# Altium schematic sheet multiplexers.SchDoc
size Letter
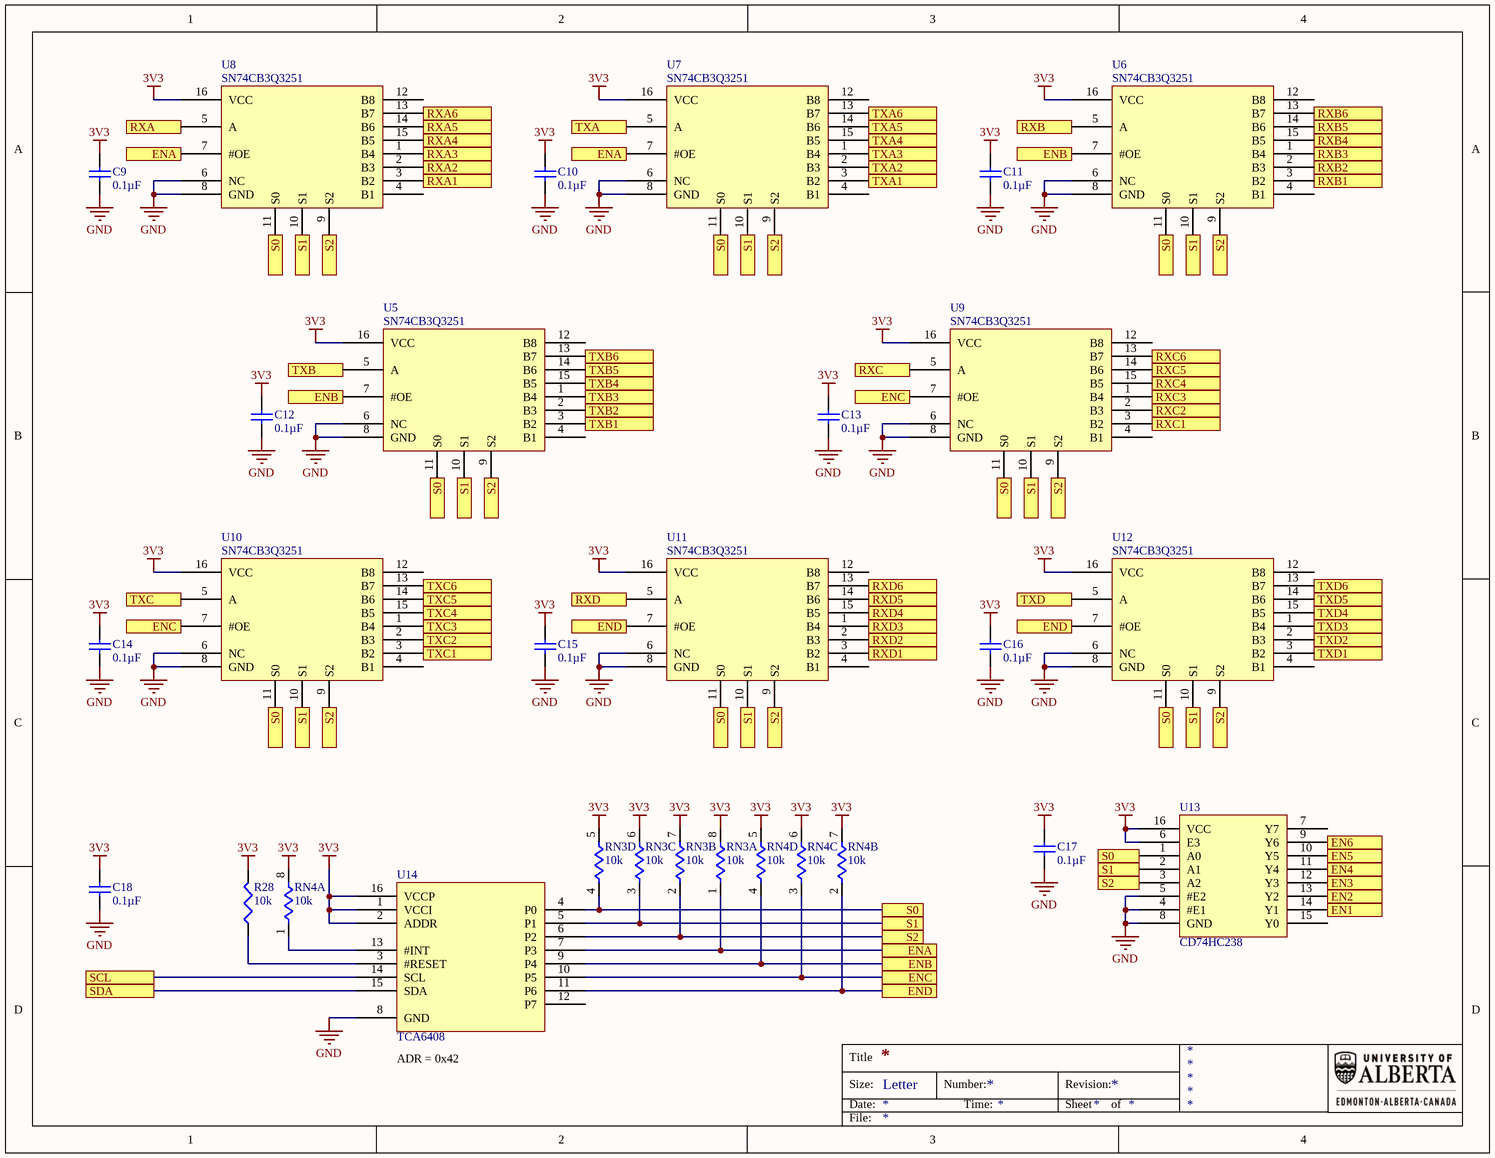
[diagram p0: multiplexers.SchDoc]

## Parts
C9  value 0.1µF  [TDK-CGA3E]  (hidden comment: Cap)
C10  value 0.1µF  [TDK-CGA3E]  (hidden comment: Cap)
C11  value 0.1µF  [TDK-CGA3E]  (hidden comment: Cap)
C12  value 0.1µF  [TDK-CGA3E]  (hidden comment: Cap)
C13  value 0.1µF  [TDK-CGA3E]  (hidden comment: Cap)
C14  value 0.1µF  [TDK-CGA3E]  (hidden comment: Cap)
C15  value 0.1µF  [TDK-CGA3E]  (hidden comment: Cap)
C16  value 0.1µF  [TDK-CGA3E]  (hidden comment: Cap)
C17  value 0.1µF  [TDK-CGA3E]  (hidden comment: Cap)
C18  value 0.1µF  [TDK-CGA3E]  (hidden comment: Cap)
R28  value 10k  [PANA-ERJ3EK]  (hidden comment: Res3)
RN3  value 10k  [PANA-EXB1206]  (hidden comment: Res4 Pack1)  (parts A,B,C,D of 4)
RN4  value 10k  [PANA-EXB1206]  (hidden comment: Res4 Pack1)  (parts A,B,C,D of 4)
U5  SN74CB3Q3251  [TI-PW]
U6  SN74CB3Q3251  [TI-PW]
U7  SN74CB3Q3251  [TI-PW]
U8  SN74CB3Q3251  [TI-PW]
U9  SN74CB3Q3251  [TI-PW]
U10  SN74CB3Q3251  [TI-PW]
U11  SN74CB3Q3251  [TI-PW]
U12  SN74CB3Q3251  [TI-PW]
U13  CD74HC238  [TI-PW]
U14  TCA6408  [TI-PW]

## Ports
EN1, EN2, EN3, EN4, EN5, EN6, ENA, ENB, ENC, END, RXA, RXA1, RXA2, RXA3, RXA4, RXA5, RXA6, RXB, RXB1, RXB2, RXB3, RXB4, RXB5, RXB6, RXC, RXC1, RXC2, RXC3, RXC4, RXC5, RXC6, RXD, RXD1, RXD2, RXD3, RXD4, RXD5, RXD6, S0, S1, S2, SCL, SDA, TXA, TXA1, TXA2, TXA3, TXA4, TXA5, TXA6, TXB, TXB1, TXB2, TXB3, TXB4, TXB5, TXB6, TXC, TXC1, TXC2, TXC3, TXC4, TXC5, TXC6, TXD, TXD1, TXD2, TXD3, TXD4, TXD5, TXD6

## Nets
3V3: C9.2 C10.2 C11.2 C12.2 C13.2 C14.2 C15.2 C16.2 C17.2 C18.2 R28.2 RN3.5 RN3.6 RN3.7 RN3.8 RN4.5 RN4.6 RN4.7 RN4.8 U5.16(VCC) U6.16(VCC) U7.16(VCC) U8.16(VCC) U9.16(VCC) U10.16(VCC) U11.16(VCC) U12.16(VCC) U13.6(E3) U13.16(VCC) U14.1(VCCI) U14.2(ADDR) U14.16(VCCP)
GND: C9.1 C10.1 C11.1 C12.1 C13.1 C14.1 C15.1 C16.1 C17.1 C18.1 U5.6(NC) U5.8(GND) U6.6(NC) U6.8(GND) U7.6(NC) U7.8(GND) U8.6(NC) U8.8(GND) U9.6(NC) U9.8(GND) U10.6(NC) U10.8(GND) U11.6(NC) U11.8(GND) U12.6(NC) U12.8(GND) U13.4(#E1) U13.5(#E2) U13.8(GND) U14.8(GND)
EN1: U13.14(Y1) ; port EN1
EN2: U13.13(Y2) ; port EN2
EN3: U13.12(Y3) ; port EN3
EN4: U13.11(Y4) ; port EN4
EN5: U13.10(Y5) ; port EN5
EN6: U13.9(Y6) ; port EN6
ENA: RN3.1 U7.7(#OE) U8.7(#OE) U14.7(P3) ; port ENA
ENB: RN4.4 U5.7(#OE) U6.7(#OE) U14.9(P4) ; port ENB
ENC: RN4.3 U9.7(#OE) U10.7(#OE) U14.10(P5) ; port ENC
END: RN4.2 U11.7(#OE) U12.7(#OE) U14.11(P6) ; port END
RXA: U8.5(A) ; port RXA
RXA1: U8.3(B2) ; port RXA1
RXA2: U8.2(B3) ; port RXA2
RXA3: U8.1(B4) ; port RXA3
RXA4: U8.15(B5) ; port RXA4
RXA5: U8.14(B6) ; port RXA5
RXA6: U8.13(B7) ; port RXA6
RXB: U6.5(A) ; port RXB
RXB1: U6.3(B2) ; port RXB1
RXB2: U6.2(B3) ; port RXB2
RXB3: U6.1(B4) ; port RXB3
RXB4: U6.15(B5) ; port RXB4
RXB5: U6.14(B6) ; port RXB5
RXB6: U6.13(B7) ; port RXB6
RXC: U9.5(A) ; port RXC
RXC1: U9.3(B2) ; port RXC1
RXC2: U9.2(B3) ; port RXC2
RXC3: U9.1(B4) ; port RXC3
RXC4: U9.15(B5) ; port RXC4
RXC5: U9.14(B6) ; port RXC5
RXC6: U9.13(B7) ; port RXC6
RXD: U11.5(A) ; port RXD
RXD1: U11.3(B2) ; port RXD1
RXD2: U11.2(B3) ; port RXD2
RXD3: U11.1(B4) ; port RXD3
RXD4: U11.15(B5) ; port RXD4
RXD5: U11.14(B6) ; port RXD5
RXD6: U11.13(B7) ; port RXD6
S0: RN3.4 U5.11(S0) U6.11(S0) U7.11(S0) U8.11(S0) U9.11(S0) U10.11(S0) U11.11(S0) U12.11(S0) U13.1(A0) U14.4(P0) ; port S0
S1: RN3.3 U5.10(S1) U6.10(S1) U7.10(S1) U8.10(S1) U9.10(S1) U10.10(S1) U11.10(S1) U12.10(S1) U13.2(A1) U14.5(P1) ; port S1
S2: RN3.2 U5.9(S2) U6.9(S2) U7.9(S2) U8.9(S2) U9.9(S2) U10.9(S2) U11.9(S2) U12.9(S2) U13.3(A2) U14.6(P2) ; port S2
SCL: U14.14(SCL) ; port SCL
SDA: U14.15(SDA) ; port SDA
TXA: U7.5(A) ; port TXA
TXA1: U7.3(B2) ; port TXA1
TXA2: U7.2(B3) ; port TXA2
TXA3: U7.1(B4) ; port TXA3
TXA4: U7.15(B5) ; port TXA4
TXA5: U7.14(B6) ; port TXA5
TXA6: U7.13(B7) ; port TXA6
TXB: U5.5(A) ; port TXB
TXB1: U5.3(B2) ; port TXB1
TXB2: U5.2(B3) ; port TXB2
TXB3: U5.1(B4) ; port TXB3
TXB4: U5.15(B5) ; port TXB4
TXB5: U5.14(B6) ; port TXB5
TXB6: U5.13(B7) ; port TXB6
TXC: U10.5(A) ; port TXC
TXC1: U10.3(B2) ; port TXC1
TXC2: U10.2(B3) ; port TXC2
TXC3: U10.1(B4) ; port TXC3
TXC4: U10.15(B5) ; port TXC4
TXC5: U10.14(B6) ; port TXC5
TXC6: U10.13(B7) ; port TXC6
TXD: U12.5(A) ; port TXD
TXD1: U12.3(B2) ; port TXD1
TXD2: U12.2(B3) ; port TXD2
TXD3: U12.1(B4) ; port TXD3
TXD4: U12.15(B5) ; port TXD4
TXD5: U12.14(B6) ; port TXD5
TXD6: U12.13(B7) ; port TXD6
NetR28_1: R28.1 U14.3(#RESET)
NetRN4_1: RN4.1 U14.13(#INT)

Not connected (* = marked no-connect by the designer): U5 4(B1) 12(B8); U6 4(B1) 12(B8); U7 4(B1) 12(B8); U8 4(B1) 12(B8); U9 4(B1) 12(B8); U10 4(B1) 12(B8); U11 4(B1) 12(B8); U12 4(B1) 12(B8); U13 7(Y7) 15(Y0); U14 12(P7)

## Notes on the sheet
- (near U14) ADR = 0x42
- Title
- Size:
- Date:
- Letter
- Number:
- Time:
- Revision:
- Sheet
- of
- File:

## Library data of the parts
C9-C18 = PC-TDK-02273: CAP CER 0.1UF 50V X8R 0603; Manufacturer Part Number: CGA3E3X8R1H104M080AB; Index: 2273; Designator: C?; Tolerance: ±20%; Published: 3/16/2016; LatestRevisionDate: 3/16/2016; LatestRevisionNote: ...; PackageReference: 0603 (1608 Metric); Publisher: AlbertaSat; PackageDescription: Radial Cap, Thru-Hole; 2 Leads; 0.3 in Pin Spacing; Part Number: PC-TDK-02273; Supplier Part Number 1: 445-12607-1-ND; Supplier 1: Digi-key; Supplier Link: http://www.digikey.ca/product-search/en?keywords=445-12607-1-ND; Voltage - Rated: 50V; Temperature Coefficient: X8R; Applications: Automotive
R28 = 17203: RES SMD 10K OHM 1% 1/10W 0603; Part Number: 17203; Manufacturer Part Number: ERJ-3EKF1002V; Designator: R?; Power: 0.1W, 1/10W; Temperature Coefficient: ±100ppm/°C; Published: 8-Jun-2000; LatestRevisionDate: 29-May-2009; LatestRevisionNote: IPC-7351 Footprint Added.; PackageReference: 0603 (1608 Metric); Publisher: Altium Limited; PackageDescription: Chip Resistor, 2-Leads, Body 1.60x0.80mm, IPC Low Density; Supplier Part Number 1: P10.0KHCT-ND; Supplier 1: Digi-Key; Supplier Link: http://www.digikey.ca/product-search/en?keywords=P10.0KHCT-ND; Tolerance: ±1%
RN3 RN4 = 19842: RES ARRAY 4 RES 10K OHM 1206; Part Number: 19842; Manufacturer Part Number: EXB-38V103JV; Sim Note: Enter the Resistance value into parameter field.; Designator: RN?; Tolerance: ±5%; Power: 62.5mW; Temperature Coefficient: ±200ppm/°C; Code_JEDEC: MS-012-AC; Supplier Part Number 1: Y9103CT-ND; Supplier 1: Digi-Key; Supplier Link: http://www.digikey.ca/product-search/en?keywords=Y9103CT-ND; PackageReference: 1206 (3216 Metric), Convex, Long Side Terminals; PackageDescription: Chip Array, ConvexS, 8-Leads, Pitch 0.80mm,  Body 3.20x1.60mm,  IPC Low Density
U5-U12 = 42: IC HI-BAND MUX/DEMUX 16-TSSOP; Part Number: 42; Manufacturer Part Number: SN74CB3Q3251PWR; Designator: U?; Supplier Part Number 2: 595-SN74CB3Q3251PWR; Supplier 2: Mouser; Supplier Part Number 1: 296-18204-1-ND; Supplier 1: Digi-Key; Supplier Link: #https://www.digikey.ca/product-detail/en/texas-instruments/SN74CB3Q3251PWR/296-18204-1-ND/773829#; PackageReference: TI-TSSOP16
U13 = 45: IC DECODER/DEMUX HS 3-8 16TSSOP; Part Number: 45; Manufacturer Part Number: CD74HC238PW; Designator: U?; Supplier Part Number 2: 595-CD74HC238PWR; Supplier 2: Mouser; Supplier Part Number 1: 296-33050-5-ND; Supplier 1: Digi-Key; Supplier Link: #https://www.digikey.ca/product-detail/en/texas-instruments/CD74HC238PW/296-33050-5-ND/1506874#; PackageReference: TI-16TSSOP
U14 = 46: IC I/O EXPANDER I2C 8B 16TSSOP; Part Number: 46; Manufacturer Part Number: TCA6408AQPWRQ1; Designator: U?; Supplier Part Number 2: 595-TCA6408AQPWRQ1; Supplier 2: Mouser; Supplier Part Number 1: 296-44902-1-ND; Supplier 1: Digi-Key; Supplier Link: #https://www.digikey.com/products/en/integrated-circuits-ics/interface-i-o-expanders/749?k=&pkeyword=&s=39106&FV=1c0002%2C1c0006%2C4032eb%2C403305%2C40346d%2C4035f0%2C1140003%2C26800c4%2C2680042%2C2680043%2C274001d%2C2740253%2C1f140000%2Cffe002ed%2Cfffc0128&quantity=0&ColumnSort=0&page=1&stock=1&pageSize=250#; PackageReference: TI-16TSSOP